# Altium schematic sheet 11_MYIR.SchDoc: =TitleParameter
size A3; Address: Crete IL; Organization: ASISGUARD; Address1: Kemalpasa, Kemalpasa Cd. No:290 D:292H, 35060 Bornova/Izmir/Turkey
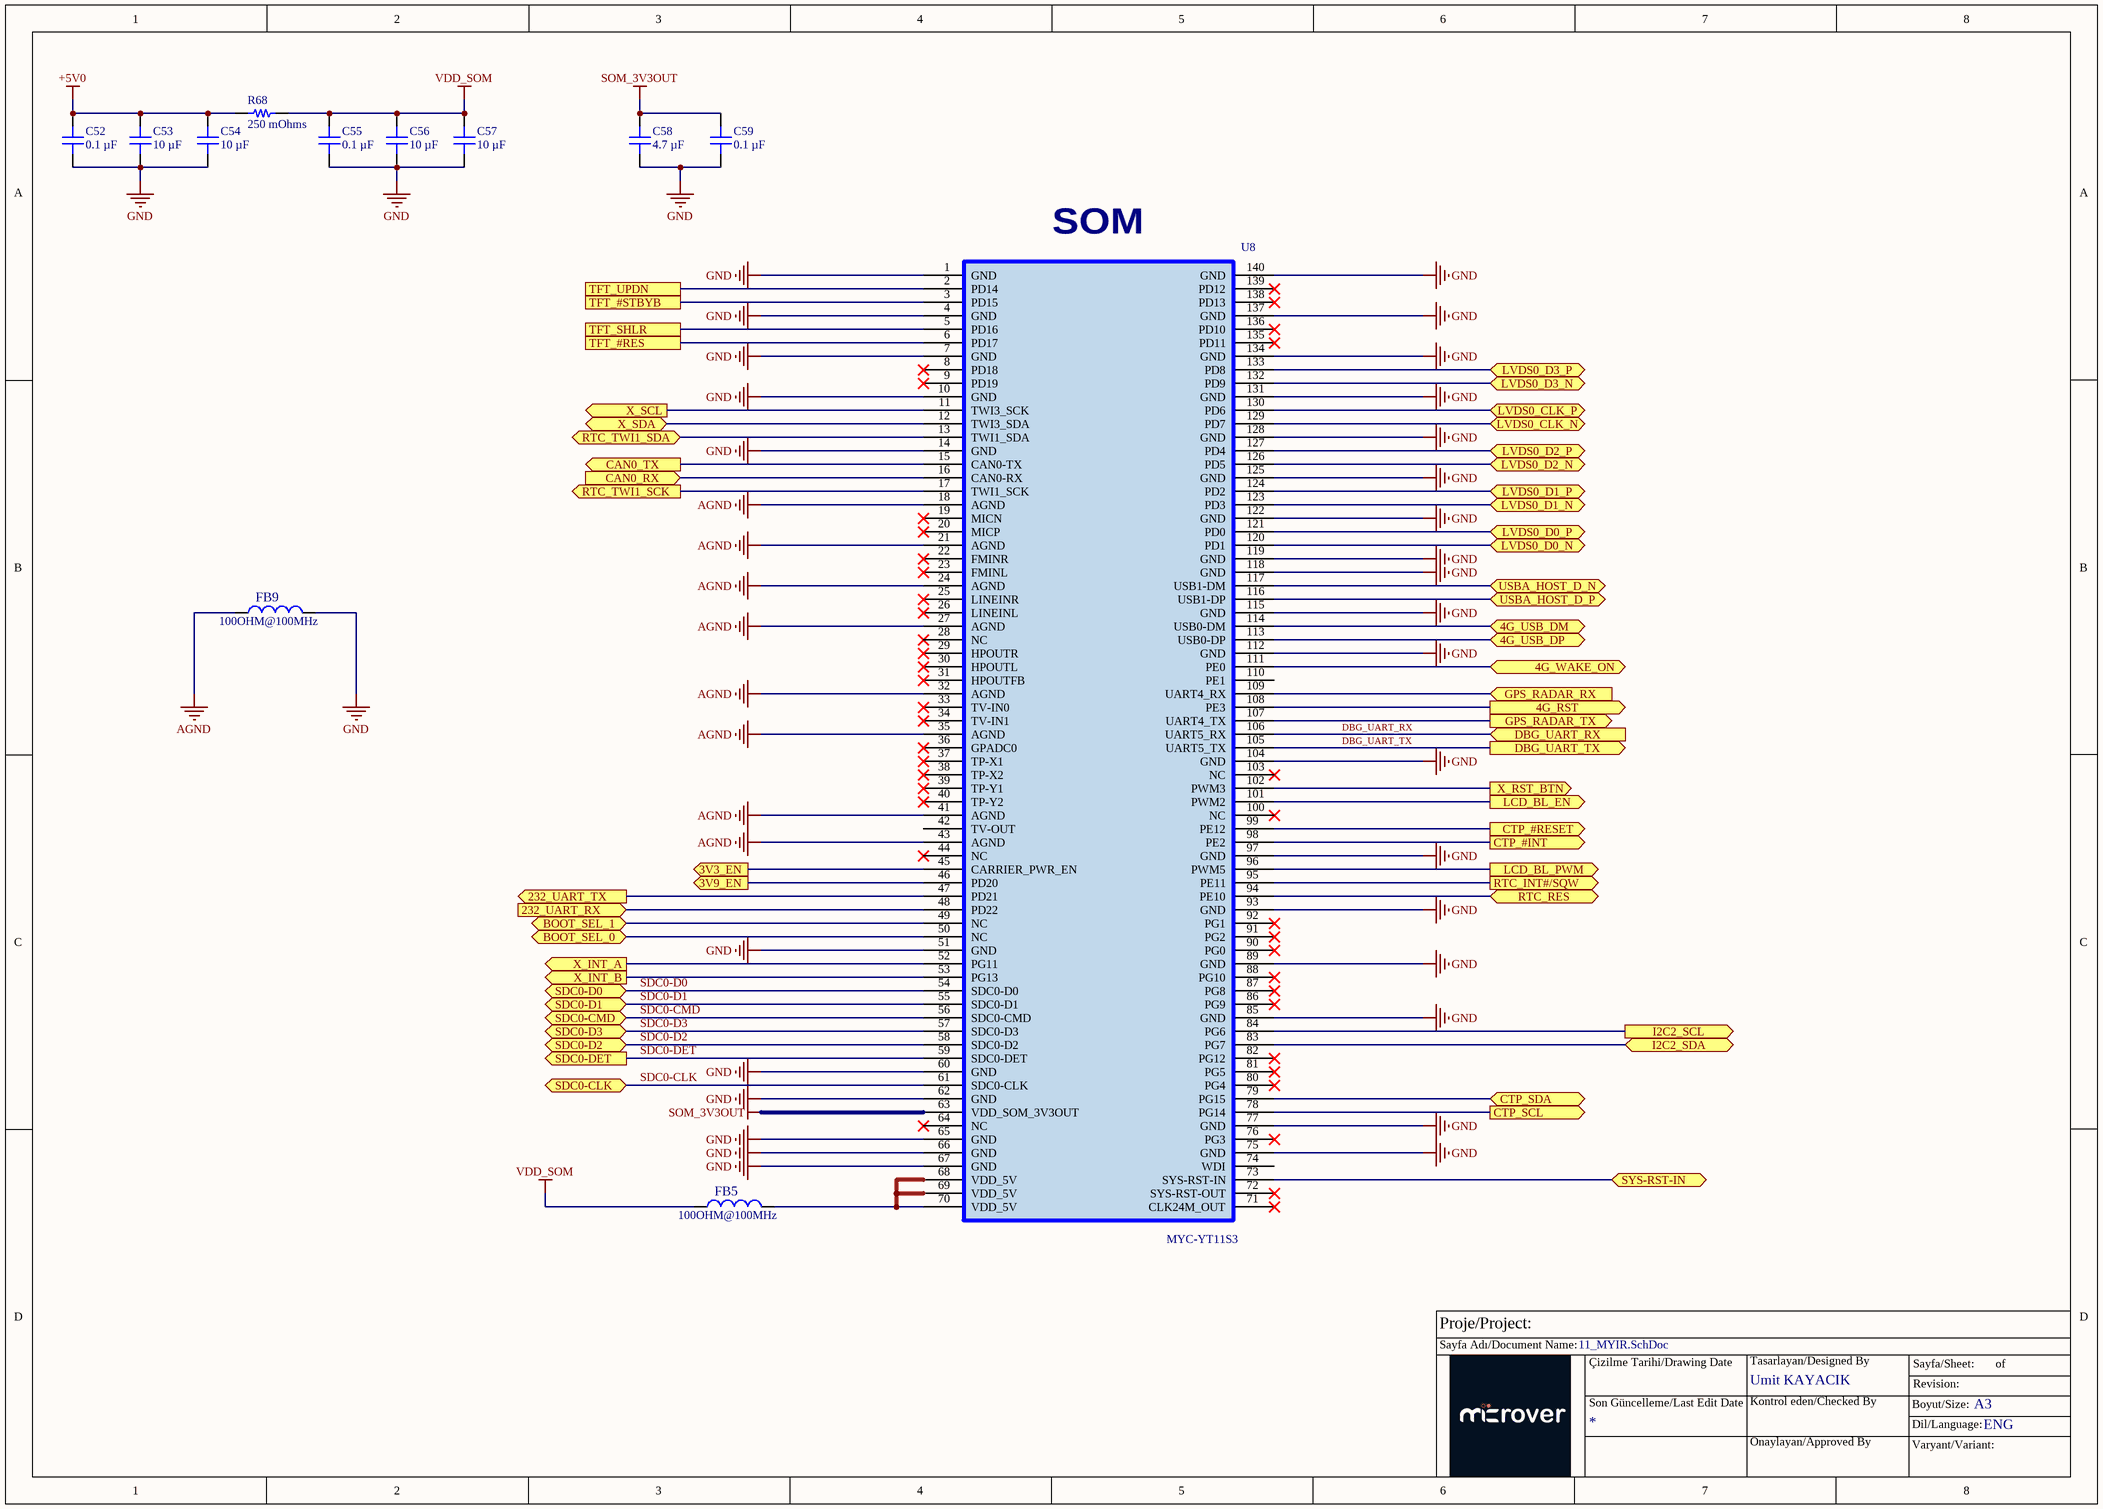
[diagram p0: 11_MYIR.SchDoc]

## Parts
C52  0.1 µF  [CAP 0603_1608]
C53  10 µF  [CAP 0603_1608]
C54  10 µF  [CAP 0603_1608]
C55  0.1 µF  [CAP 0603_1608]
C56  10 µF  [CAP 0603_1608]
C57  10 µF  [CAP 0603_1608]
C58  4.7 µF  [CAP 0603_1608]
C59  0.1 µF  [CAP 0603_1608]
FB5  100OHM@100MHz  [FB 0603(1608)]
FB9  100OHM@100MHz  [FB 0603(1608)]
R68  250 mOhms  [RES 1206_3216]
U8  MYC-YT11S3  [YOUPK37X39_1_00-SMD-148]

## Ports
3V3_EN (out), 3V9_EN (out), 4G_RST (out), 4G_USB_DM (bidir), 4G_USB_DP (bidir), 4G_WAKE_ON (bidir), 232_UART_RX (in), 232_UART_TX (out), BOOT_SEL_0 (bidir), BOOT_SEL_1 (bidir), CAN0_RX (in), CAN0_TX (out), CTP_#INT (out), CTP_#RESET (out), CTP_SCL (out), CTP_SDA (bidir), DBG_UART_RX (in), DBG_UART_TX (out), GPS_RADAR_RX (in), GPS_RADAR_TX (out), I2C2_SCL (out), I2C2_SDA (bidir), LCD_BL_EN (out), LCD_BL_PWM (out), LVDS0_CLK_N (bidir), LVDS0_CLK_P (bidir), LVDS0_D0_N (bidir), LVDS0_D0_P (bidir), LVDS0_D1_N (bidir), LVDS0_D1_P (bidir), LVDS0_D2_N (bidir), LVDS0_D2_P (bidir), LVDS0_D3_N (bidir), LVDS0_D3_P (bidir), RTC_INT#/SQW (out), RTC_RES (bidir), RTC_TWI1_SCK (out), RTC_TWI1_SDA (bidir), SDC0-CLK (bidir), SDC0-CMD (bidir), SDC0-D0 (bidir), SDC0-D1 (bidir), SDC0-D2 (bidir), SDC0-D3 (bidir), SDC0-DET (out), SYS-RST-IN (bidir), TFT_#RES, TFT_#STBYB, TFT_SHLR, TFT_UPDN, USBA_HOST_D_N (bidir), USBA_HOST_D_P (bidir), X_INT_A (out), X_INT_B (out), X_RST_BTN (out), X_SCL (out), X_SDA (bidir)

## Nets
+5V0: C52.2 C53.2 C54.2 R68.2
AGND: FB9.2 U8.18(AGND) U8.21(AGND) U8.24(AGND) U8.27(AGND) U8.32(AGND) U8.35(AGND) U8.41(AGND) U8.43(AGND)
GND: C52.1 C53.1 C54.1 C55.1 C56.1 C57.1 C58.1 C59.1 FB9.1 U8.1(GND) U8.4(GND) U8.7(GND) U8.10(GND) U8.14(GND) U8.51(GND) U8.60(GND) U8.62(GND) U8.65(GND) U8.66(GND) U8.67(GND) U8.75(GND) U8.77(GND) U8.85(GND) U8.89(GND) U8.93(GND) U8.97(GND) U8.104(GND) U8.112(GND) U8.115(GND) U8.118(GND) U8.119(GND) U8.122(GND) U8.125(GND) U8.128(GND) U8.131(GND) U8.134(GND) U8.137(GND) U8.140(GND)
SOM_3V3OUT: C58.2 C59.2 U8.63(VDD_SOM_3V3OUT)
VDD_SOM: C55.2 C56.2 C57.2 FB5.2 R68.1
3V3_EN: U8.45(CARRIER_PWR_EN) ; port 3V3_EN
3V9_EN: U8.46(PD20) ; port 3V9_EN
4G_RST: U8.108(PE3) ; port 4G_RST
4G_USB_DM: U8.114(USB0-DM) ; port 4G_USB_DM
4G_USB_DP: U8.113(USB0-DP) ; port 4G_USB_DP
4G_WAKE_ON: U8.111(PE0) ; port 4G_WAKE_ON
232_UART_RX: U8.48(PD22) ; port 232_UART_RX
232_UART_TX: U8.47(PD21) ; port 232_UART_TX
BOOT_SEL_0: U8.50(NC) ; port BOOT_SEL_0
BOOT_SEL_1: U8.49(NC) ; port BOOT_SEL_1
CAN0_RX: U8.16(CAN0-RX) ; port CAN0_RX
CAN0_TX: U8.15(CAN0-TX) ; port CAN0_TX
CTP_#INT: U8.98(PE2) ; port CTP_#INT
CTP_#RESET: U8.99(PE12) ; port CTP_#RESET
CTP_SCL: U8.78(PG14) ; port CTP_SCL
CTP_SDA: U8.79(PG15) ; port CTP_SDA
DBG_UART_RX: U8.106(UART5_RX) ; port DBG_UART_RX
DBG_UART_TX: U8.105(UART5_TX) ; port DBG_UART_TX
GPS_RADAR_RX: U8.109(UART4_RX) ; port GPS_RADAR_RX
GPS_RADAR_TX: U8.107(UART4_TX) ; port GPS_RADAR_TX
I2C2_SCL: U8.84(PG6) ; port I2C2_SCL
I2C2_SDA: U8.83(PG7) ; port I2C2_SDA
LCD_BL_EN: U8.101(PWM2) ; port LCD_BL_EN
LCD_BL_PWM: U8.96(PWM5) ; port LCD_BL_PWM
LVDS0_CLK_N: U8.129(PD7) ; port LVDS0_CLK_N
LVDS0_CLK_P: U8.130(PD6) ; port LVDS0_CLK_P
LVDS0_D0_N: U8.120(PD1) ; port LVDS0_D0_N
LVDS0_D0_P: U8.121(PD0) ; port LVDS0_D0_P
LVDS0_D1_N: U8.123(PD3) ; port LVDS0_D1_N
LVDS0_D1_P: U8.124(PD2) ; port LVDS0_D1_P
LVDS0_D2_N: U8.126(PD5) ; port LVDS0_D2_N
LVDS0_D2_P: U8.127(PD4) ; port LVDS0_D2_P
LVDS0_D3_N: U8.132(PD9) ; port LVDS0_D3_N
LVDS0_D3_P: U8.133(PD8) ; port LVDS0_D3_P
RTC_INT#/SQW: U8.95(PE11) ; port RTC_INT#/SQW
RTC_RES: U8.94(PE10) ; port RTC_RES
RTC_TWI1_SCK: U8.17(TWI1_SCK) ; port RTC_TWI1_SCK
RTC_TWI1_SDA: U8.13(TWI1_SDA) ; port RTC_TWI1_SDA
SDC0-CLK: U8.61(SDC0-CLK) ; port SDC0-CLK
SDC0-CMD: U8.56(SDC0-CMD) ; port SDC0-CMD
SDC0-D0: U8.54(SDC0-D0) ; port SDC0-D0
SDC0-D1: U8.55(SDC0-D1) ; port SDC0-D1
SDC0-D2: U8.58(SDC0-D2) ; port SDC0-D2
SDC0-D3: U8.57(SDC0-D3) ; port SDC0-D3
SDC0-DET: U8.59(SDC0-DET) ; port SDC0-DET
SYS-RST-IN: U8.73(SYS-RST-IN) ; port SYS-RST-IN
TFT_#RES: U8.6(PD17) ; port TFT_#RES
TFT_#STBYB: U8.3(PD15) ; port TFT_#STBYB
TFT_SHLR: U8.5(PD16) ; port TFT_SHLR
TFT_UPDN: U8.2(PD14) ; port TFT_UPDN
USBA_HOST_D_N: U8.117(USB1-DM) ; port USBA_HOST_D_N
USBA_HOST_D_P: U8.116(USB1-DP) ; port USBA_HOST_D_P
X_INT_A: U8.52(PG11) ; port X_INT_A
X_INT_B: U8.53(PG13) ; port X_INT_B
X_RST_BTN: U8.102(PWM3) ; port X_RST_BTN
X_SCL: U8.11(TWI3_SCK) ; port X_SCL
X_SDA: U8.12(TWI3_SDA) ; port X_SDA
NetFB5_1: FB5.1 U8.68(VDD_5V) U8.69(VDD_5V) U8.70(VDD_5V)

Not connected (* = marked no-connect by the designer): U8 8(PD18)* 9(PD19)* 19(MICN)* 20(MICP)* 22(FMINR)* 23(FMINL)* 25(LINEINR)* 26(LINEINL)* 28(NC)* 29(HPOUTR)* 30(HPOUTL)* 31(HPOUTFB)* 33(TV-IN0)* 34(TV-IN1)* 36(GPADC0)* 37(TP-X1)* 38(TP-X2)* 39(TP-Y1)* 40(TP-Y2)* 42(TV-OUT) 44(NC)* 64(NC)* 71(CLK24M_OUT)* 72(SYS-RST-OUT)* 74(WDI) 76(PG3)* 80(PG4)* 81(PG5)* 82(PG12)* 86(PG9)* 87(PG8)* 88(PG10)* 90(PG0)* 91(PG2)* 92(PG1)* 100(NC)* 103(NC)* 110(PE1) 135(PD11)* 136(PD10)* 138(PD13)* 139(PD12)*

## Notes on the sheet
- (near U8) SOM
- POWER OUTPUT
- (near FB5) POWER INPUT
- Proje/Project:
- Sayfa Adı/Document Name:
- Çizilme Tarihi/Drawing Date
- Umit KAYACIK
- Tasarlayan/Designed By
- Sayfa/Sheet:
- Revision:
- of
- Son Güncelleme/Last Edit Date
- Kontrol eden/Checked By
- Onaylayan/Approved By
- Boyut/Size:
- Varyant/Variant:
- Dil/Language:
- A3
- ENG

## Library data of the parts
C52 C55 C59 = VJ0603Y104MXJPW1BC: CAP CER 0.1UF 16V X7R 0603; manufacturer: Vishay Vitramon; Tolerance: ±20%; Part Number: VJ0603Y104MXJPW1BC; Value: 0.1 µF; Applications: General Purpose; Capacitance: 0.1 µF; componentlink1description: Datasheet; componentlink1url: https://www.vishay.com/docs/28548/vjw1bcbascomseries.pdf; componentlink2description: DigiKey Link; componentlink2url: https://www.digikey.com/en/products/detail/vishay-vitramon/VJ0603Y104MXJPW1BC/8305322; Device Package: 0603 (1608 Metric); lastupdated: 2/9/2024 8:09:54 PM; Lifecycle Status: Active; Minimum Order: 1; Mounting Type: Surface Mount, MLCC; Operating Temperature: -55°C ~ 125°C; Package / Case: 0603 (1608 Metric); packaging: TapeAndReel; partid: 34420; Part Status: Active; price: 0.01; series: VJ W1BC; Size / Dimension: 0.063" L x 0.031" W (1.60mm x 0.80mm); Supplier 1: DigiKey; Supplier Part Number 1: 720-VJ0603Y104MXJPW1BCCT-ND; Temperature Coefficient: X7R; Thickness (Max): 0.034" (0.87mm); Voltage - Rated: 16V
C53 C54 C56 C57 = ZRB18AR61C106ME01L: CAP CER 10UF 16V X5R 0603; manufacturer: Murata Electronics; Tolerance: ±20%; Part Number: ZRB18AR61C106ME01L; Value: 10 µF; Applications: Acoustic Noise Reduction; Capacitance: 10 µF; componentlink1description: Datasheet; componentlink1url: https://search.murata.co.jp/Ceramy/image/img/A01X/G101/ENG/ZRB18AR61C106ME01-01.pdf; componentlink2description: DigiKey Link; componentlink2url: https://www.digikey.com/en/products/detail/murata-electronics/ZRB18AR61C106ME01L/5321082; Device Package: 0603 (1608 Metric); Features: Interposer Termination; lastupdated: 2/9/2024 8:10:10 PM; Lifecycle Status: Active; Minimum Order: 1; Mounting Type: Surface Mount, MLCC; Operating Temperature: -55°C ~ 85°C; Package / Case: 0603 (1608 Metric); packaging: TapeAndReel; partid: 16007; Part Status: Active; price: 0.08; series: ZRB; Size / Dimension: 0.063" L x 0.031" W (1.60mm x 0.80mm); Supplier 1: DigiKey; Supplier Part Number 1: 490-10990-1-ND; Temperature Coefficient: X5R; Thickness (Max): 0.047" (1.20mm); Voltage - Rated: 16V
C58 = KGM15BR51C475KT: CAP CER 4.7UF 16V X5R 0603; manufacturer: KYOCERA AVX; Tolerance: ±10%; Part Number: KGM15BR51C475KT; Value: 4.7 µF; Applications: General Purpose; Capacitance: 4.7 µF; componentlink1description: Datasheet; componentlink1url: https://datasheets.kyocera-avx.com/cx5r.pdf; componentlink2description: DigiKey Link; componentlink2url: https://www.digikey.com/en/products/detail/kyocera-avx/KGM15BR51C475KT/9748483; Device Package: 0603 (1608 Metric); lastupdated: 2/9/2024 8:09:11 PM; Lifecycle Status: Active; Minimum Order: 1; Mounting Type: Surface Mount, MLCC; Operating Temperature: -55°C ~ 85°C; Package / Case: 0603 (1608 Metric); packaging: TapeAndReel; partid: 53181; Part Status: Active; price: 0.09; series: KGM - X5R; Size / Dimension: 0.063" L x 0.031" W (1.60mm x 0.80mm); Supplier 1: DigiKey; Supplier Part Number 1: 478-KGM15BR51C475KTCT-ND; Temperature Coefficient: X5R; Thickness (Max): 0.037" (0.95mm); Voltage - Rated: 16V
FB5 FB9 = FB0603_100OHM_100MHz: 100 Ohms @ 100 MHz 1 Power Line Ferrite Bead 0603 (1608 Metric) 2A 40mOhm; Manufacturer: TDK; Manufacturer Part Number: MPZ1608Y101BTA00; Tolerance: 25%; Impedance: 100R; DC Resistance (DCR): 40mR; ComponentLink1URL: https://chn-vm-apps.microchip.com/mchprepo/parts/Datasheets/beads_commercial_power_mpz_en.pdf; ComponentLink1Description: Datasheet; Supplier 1: Digi-Key; Supplier Part Number 1: 445-2984-1-ND; RoHS: Yes; Category: Ferrite Beads and Chips; Stock 1: 551; Pricing 1: 1=0,10000, 10=0,07200, 25=0,06480, 50=0,05840, 100=0,04290, 250=0,03120, 500=0,02860, 1000=0,02470 (USD); Mount: Surface Mount; Case/Package: 0603; Case Code (Metric): 1608; Case Code (Imperial): 0603; Core Material: Ferrite; Packaging: Tape and Reel; Package Quantity: 4000; Max DC Current: 2A; Current Rating: 2A; Series: MPZ; Length: 0.063inch; Width: 0.031inch; Height: 0.037inch; RoHS Compliant: Yes; REACH SVHC: No SVHC; ComponentLink2URL: https://datasheet.ciiva.com/46634/beads-commercial-power-mpz-en-46634677.pdf?src-supplier=Digi-Key; ComponentLink2Description: https://datasheet.ciiva.com/46634/beads-commercial-power-mpz-en-46634677.pdf?src-supplier=Digi-Key; ComponentLink3URL: https://datasheet.ciiva.com/48682/beads-commercial-power-mpz-en-48682501.pdf?src-supplier=Avnet; ComponentLink3Description: https://datasheet.ciiva.com/48682/beads-commercial-power-mpz-en-48682501.pdf?src-supplier=Avnet; ComponentLink4URL: https://datasheet.ciiva.com/46634/beads-commercial-power-mpz-en-46634684.pdf?src-supplier=Digi-Key; ComponentLink4Description: https://datasheet.ciiva.com/46634/beads-commercial-power-mpz-en-46634684.pdf?src-supplier=Digi-Key; ComponentLink5URL: https://datasheet.ciiva.com/46634/beads-commercial-power-mpz-en-46634621.pdf?src-supplier=Digi-Key; ComponentLink5Description: https://datasheet.ciiva.com/46634/beads-commercial-power-mpz-en-46634621.pdf?src-supplier=Digi-Key; Parameter 1: *; LCSC Manufacturer Part Number: MPZ1608Y101BTA00; LCSC Part Number: C501996
R68 = MFHA1206R2500FC: RES 0.25 OHM 1% 1W 1206; Manufacturer: Eaton - Electronics Division; Temperature Coefficient: ±100ppm/°C; Part Number: MFHA1206R2500FC; ComponentLink1Description: Datasheet; ComponentLink1URL: https://www.eaton.com/content/dam/eaton/products/electronic-components/resources/data-sheet/eaton-mfha-automotive-smd-current-sense-resistor-metal-film-data-sheet-elx1178.pdf; ComponentLink2Description: DigiKey Link; ComponentLink2URL: https://www.digikey.com/en/products/detail/eaton-electronics-division/MFHA1206R2500FC/16713465; Composition: Metal Film; Device Package: 1206 (3216 Metric); Features: Automotive AEC-Q200, Current Sense, Moisture Resistant; Height - Seated (Max): 0.026" (0.65mm); LastUpdated: 2/9/2024 8:53:03 PM; Lifecycle Status: Active; Minimum Order: 1; Number of Terminations: 2; Operating Temperature: -55°C ~ 155°C; Package / Case: 1206 (3216 Metric); Packaging: TapeAndReel; PartId: 72444; Part Status: Active; Power (Watts): 1W; Price: 0.04; Ratings: AEC-Q200; Resistance: 250 mOhms; Series: MFHA; Size / Dimension: 0.126" L x 0.063" W (3.20mm x 1.60mm); Supplier 1: DigiKey; Supplier Part Number 1: 283-MFHA1206R2500FCCT-ND; Supplier Device Package: 1206; Tolerance: ±1%; Value: 250 mOhms
U8 = AM335X_QFN_4: PCB Footprint: youpk37x39_1_00-smd-148